# EAGLE design Big Nonaddressable Controller (EAGLE 7.7.0)
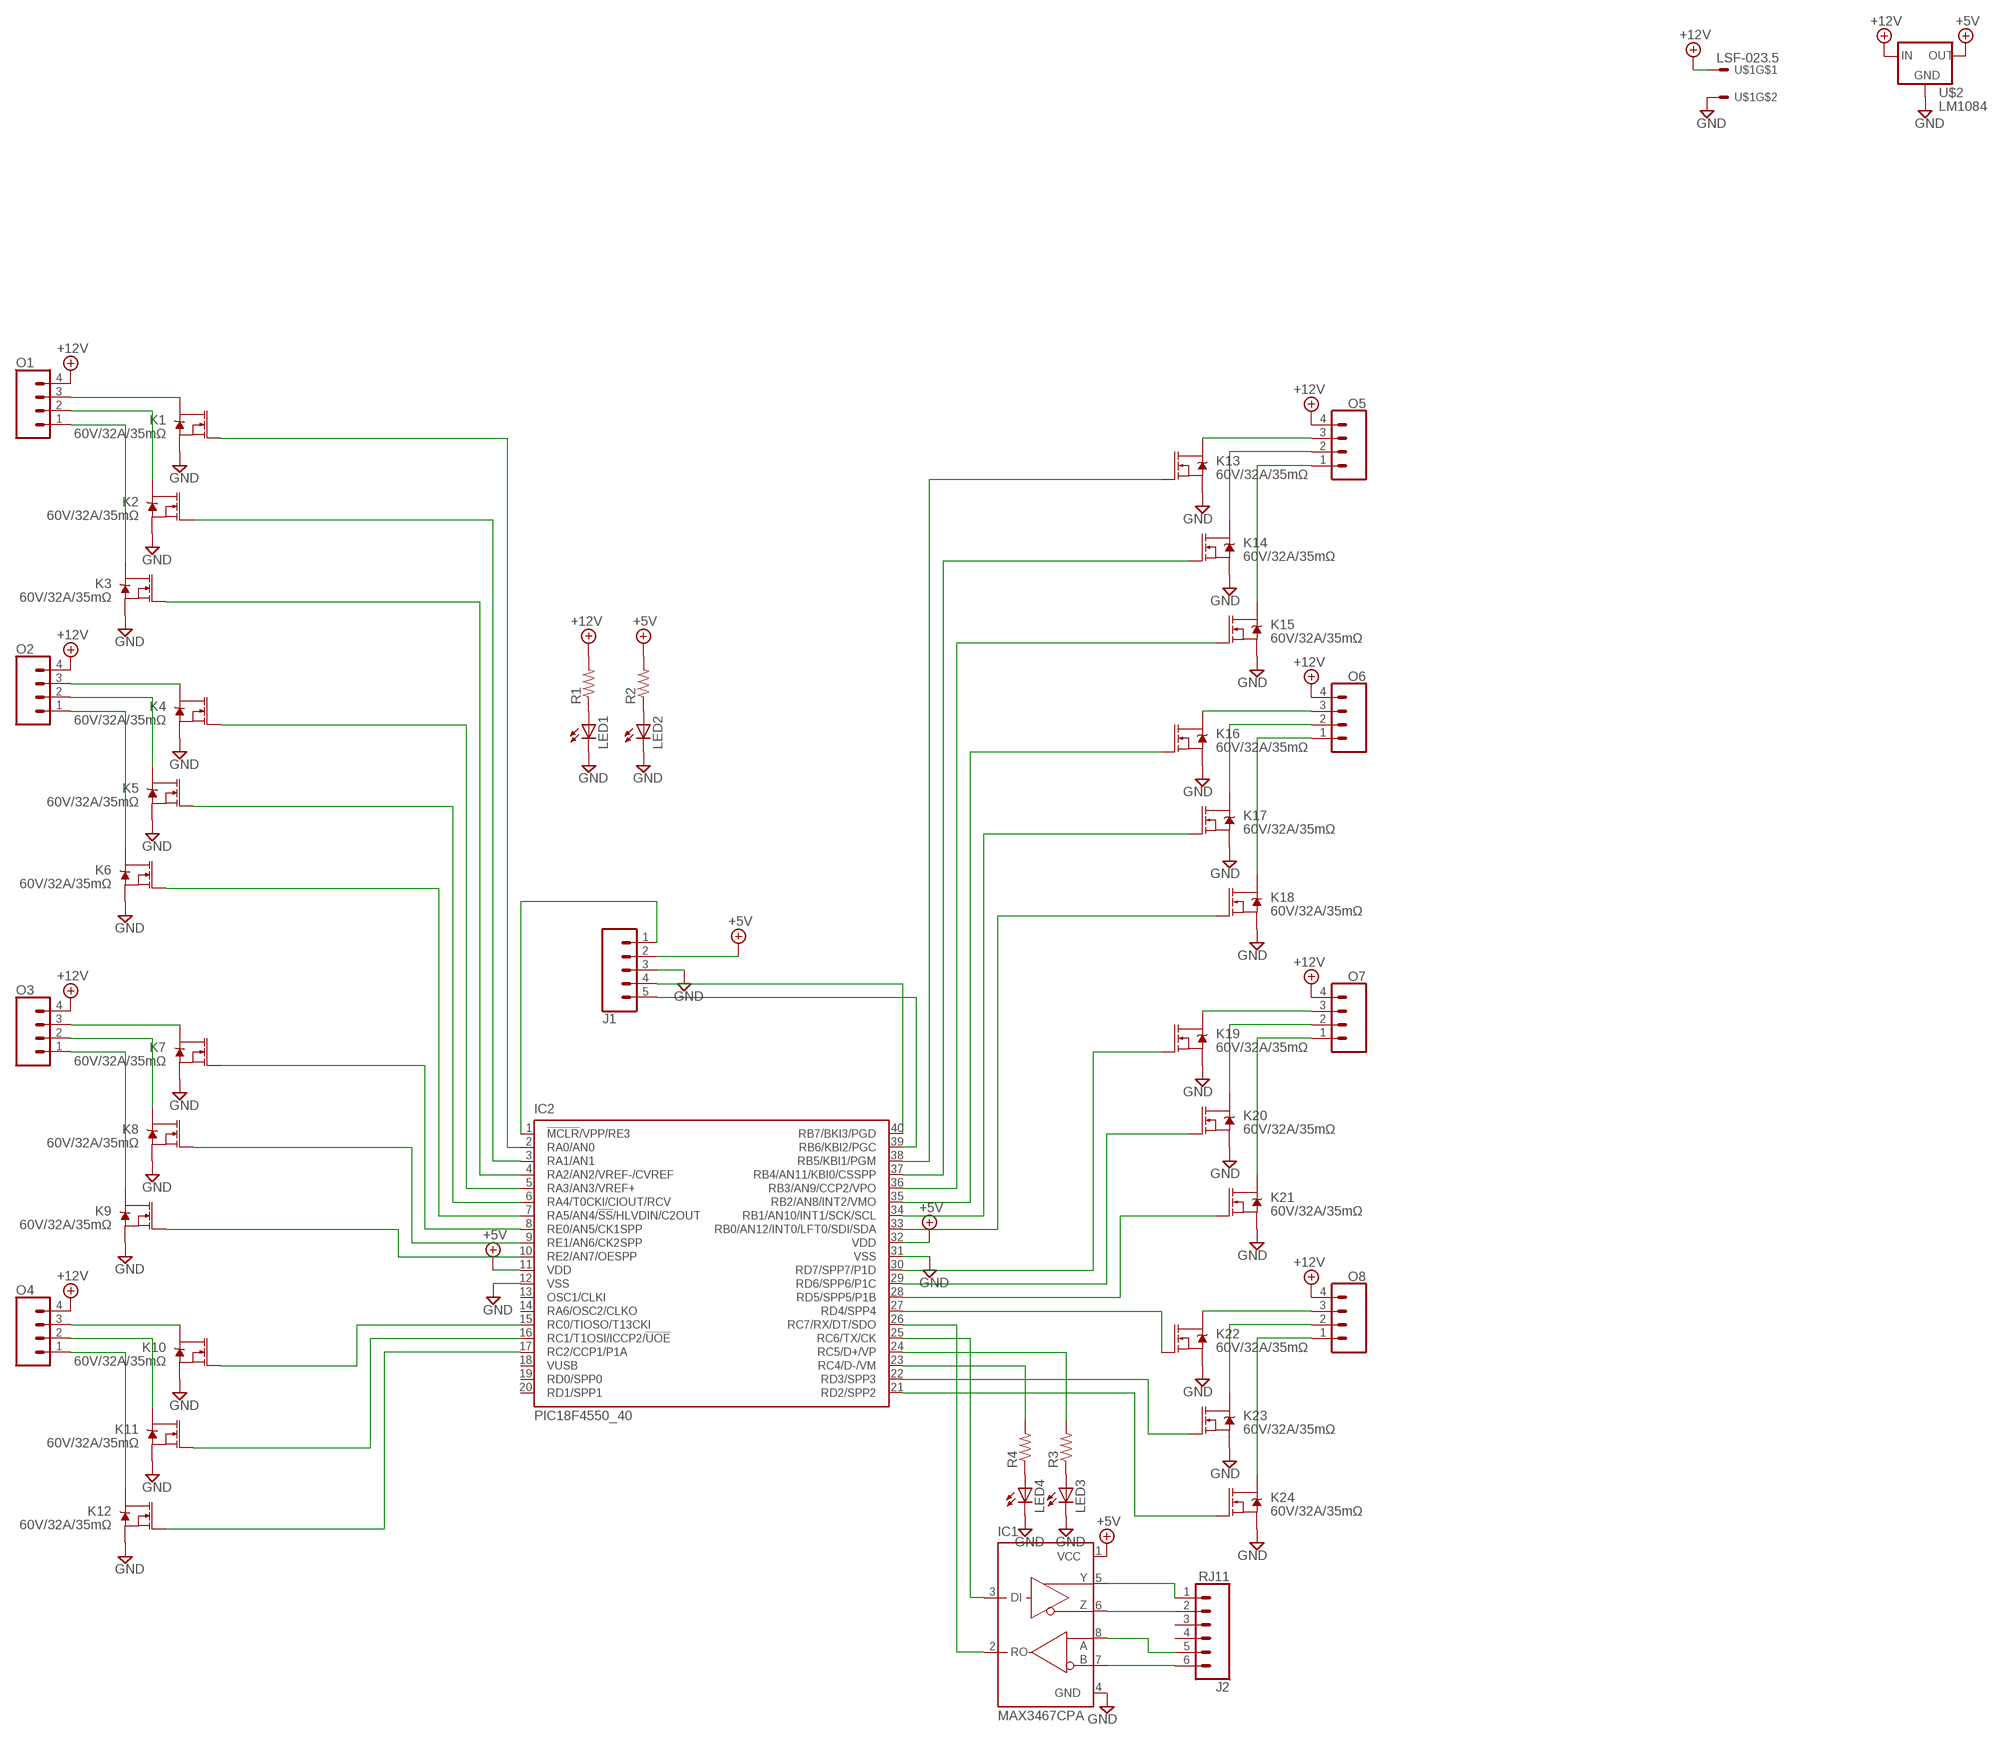
[diagram p0: schematic, sheet 1]

## Parts
IC1  MAX3467CPA  [SO08]
IC2  PIC18F4550_40  [DIL40]
J1  CONN_05  [1X05]
J2  RJ11  RJ11-6  [RJ11-6]
K1  60V/32A/35mΩ  MOSFET-NCH-FQP30N06L  [TO220V]
K2  60V/32A/35mΩ  MOSFET-NCH-FQP30N06L  [TO220V]
K3  60V/32A/35mΩ  MOSFET-NCH-FQP30N06L  [TO220V]
K4  60V/32A/35mΩ  MOSFET-NCH-FQP30N06L  [TO220V]
K5  60V/32A/35mΩ  MOSFET-NCH-FQP30N06L  [TO220V]
K6  60V/32A/35mΩ  MOSFET-NCH-FQP30N06L  [TO220V]
K7  60V/32A/35mΩ  MOSFET-NCH-FQP30N06L  [TO220V]
K8  60V/32A/35mΩ  MOSFET-NCH-FQP30N06L  [TO220V]
K9  60V/32A/35mΩ  MOSFET-NCH-FQP30N06L  [TO220V]
K10  60V/32A/35mΩ  MOSFET-NCH-FQP30N06L  [TO220V]
K11  60V/32A/35mΩ  MOSFET-NCH-FQP30N06L  [TO220V]
K12  60V/32A/35mΩ  MOSFET-NCH-FQP30N06L  [TO220V]
K13  60V/32A/35mΩ  MOSFET-NCH-FQP30N06L  [TO220V]
K14  60V/32A/35mΩ  MOSFET-NCH-FQP30N06L  [TO220V]
K15  60V/32A/35mΩ  MOSFET-NCH-FQP30N06L  [TO220V]
K16  60V/32A/35mΩ  MOSFET-NCH-FQP30N06L  [TO220V]
K17  60V/32A/35mΩ  MOSFET-NCH-FQP30N06L  [TO220V]
K18  60V/32A/35mΩ  MOSFET-NCH-FQP30N06L  [TO220V]
K19  60V/32A/35mΩ  MOSFET-NCH-FQP30N06L  [TO220V]
K20  60V/32A/35mΩ  MOSFET-NCH-FQP30N06L  [TO220V]
K21  60V/32A/35mΩ  MOSFET-NCH-FQP30N06L  [TO220V]
K22  60V/32A/35mΩ  MOSFET-NCH-FQP30N06L  [TO220V]
K23  60V/32A/35mΩ  MOSFET-NCH-FQP30N06L  [TO220V]
K24  60V/32A/35mΩ  MOSFET-NCH-FQP30N06L  [TO220V]
LED1  LED3MM  [LED3MM]
LED2  LED3MM  [LED3MM]
LED3  LED3MM  [LED3MM]
LED4  LED3MM  [LED3MM]
O1  CONN_04  [1X04]
O2  CONN_04  [1X04]
O3  CONN_04  [1X04]
O4  CONN_04  [1X04]
O5  CONN_04  [1X04]
O6  CONN_04  [1X04]
O7  CONN_04  [1X04]
O8  CONN_04  [1X04]
R1  R-US_0204/2V  [0204V]
R2  R-US_0204/2V  [0204V]
R3  R-US_0204/2V  [0204V]
R4  R-US_0204/2V  [0204V]
U$1  LSF-023.5  [LSF-3.5]
U$2  LM1084  [D2PACK]

## Nets
+5V: IC1.1(VCC) IC2.11(VDD) IC2.32(VDD) J1.2 R2.2 U$2.2(OUT)
+12V: O1.4 O2.4 O3.4 O4.4 O5.4 O6.4 O7.4 O8.4 R1.2 U$1.P$3 U$2.3(IN)
GND: IC1.4(GND) IC2.12(VSS) IC2.31(VSS) J1.3 K1.3(S) K2.3(S) K3.3(S) K4.3(S) K5.3(S) K6.3(S) K7.3(S) K8.3(S) K9.3(S) K10.3(S) K11.3(S) K12.3(S) K13.3(S) K14.3(S) K15.3(S) K16.3(S) K17.3(S) K18.3(S) K19.3(S) K20.3(S) K21.3(S) K22.3(S) K23.3(S) K24.3(S) LED1.K(C) LED2.K(C) LED3.K(C) LED4.K(C) U$1.P$4 U$2.1(GND)
N$1: IC2.40(RB7/BKI3/PGD) J1.4
N$2: IC2.39(RB6/KBI2/PGC) J1.5
N$3: IC1.2(RO) IC2.26(RC7/RX/DT/SDO)
N$4: IC1.3(DI) IC2.25(RC6/TX/CK)
N$5: K4.2(D) O2.3
N$6: K5.2(D) O2.2
N$7: K6.2(D) O2.1
N$8: IC2.2(RA0/AN0) K1.1(G)
N$9: IC2.3(RA1/AN1) K2.1(G)
N$10: IC2.4(RA2/AN2/VREF-/CVREF) K3.1(G)
N$11: IC2.1(!MCLR!/VPP/RE3) J1.1
N$12: IC2.5(RA3/AN3/VREF+) K4.1(G)
N$13: IC2.6(RA4/T0CKI/CIOUT/RCV) K5.1(G)
N$14: IC2.7(RA5/AN4/!SS!/HLVDIN/C2OUT) K6.1(G)
N$15: K7.2(D) O3.3
N$16: K8.2(D) O3.2
N$17: K9.2(D) O3.1
N$18: K10.2(D) O4.3
N$19: K11.2(D) O4.2
N$20: K12.2(D) O4.1
N$21: IC2.8(RE0/AN5/CK1SPP) K7.1(G)
N$22: IC2.9(RE1/AN6/CK2SPP) K8.1(G)
N$23: K1.2(D) O1.3
N$24: K2.2(D) O1.2
N$25: K3.2(D) O1.1
N$26: IC2.10(RE2/AN7/OESPP) K9.1(G)
N$27: IC2.17(RC2/CCP1/P1A) K12.1(G)
N$28: IC2.16(RC1/T1OSI/ICCP2/!UOE) K11.1(G)
N$29: IC2.15(RC0/TIOSO/T13CKI) K10.1(G)
N$30: K13.2(D) O5.3
N$31: K14.2(D) O5.2
N$32: K15.2(D) O5.1
N$33: IC2.38(RB5/KBI1/PGM) K13.1(G)
N$34: IC2.37(RB4/AN11/KBI0/CSSPP) K14.1(G)
N$35: IC2.36(RB3/AN9/CCP2/VPO) K15.1(G)
N$36: K16.2(D) O6.3
N$37: K17.2(D) O6.2
N$38: K18.2(D) O6.1
N$39: IC2.35(RB2/AN8/INT2/VMO) K16.1(G)
N$40: IC2.34(RB1/AN10/INT1/SCK/SCL) K17.1(G)
N$41: IC2.33(RB0/AN12/INT0/LFT0/SDI/SDA) K18.1(G)
N$42: K19.2(D) O7.3
N$43: K20.2(D) O7.2
N$44: K21.2(D) O7.1
N$45: K22.2(D) O8.3
N$46: K23.2(D) O8.2
N$47: K24.2(D) O8.1
N$48: IC2.30(RD7/SPP7/P1D) K19.1(G)
N$49: IC2.29(RD6/SPP6/P1C) K20.1(G)
N$50: IC2.28(RD5/SPP5/P1B) K21.1(G)
N$51: IC2.27(RD4/SPP4) K22.1(G)
N$52: IC2.22(RD3/SPP3) K23.1(G)
N$53: IC2.21(RD2/SPP2) K24.1(G)
N$54: IC1.7(B) J2.6
N$55: IC1.8(A) J2.5
N$56: IC1.5(Y) J2.1
N$57: IC1.6(Z) J2.2
N$58: LED1.A R1.1
N$59: LED2.A R2.1
N$60: LED3.A R3.1
N$61: LED4.A R4.1
N$62: IC2.24(RC5/D+/VP) R3.2
N$63: IC2.23(RC4/D-/VM) R4.2
Unconnected: IC2.13(OSC1/CLKI) IC2.14(RA6/OSC2/CLKO) IC2.18(VUSB) IC2.19(RD0/SPP0) IC2.20(RD1/SPP1) J2.3 J2.4

## Library data of the parts
IC1 = maxim:MAX3467*: +5V, Fail-Safe, 40Mbps, Profibus RS-485/RS-422 Transceivers Source: MAX3465-MAX3469.pdf; OC_FARNELL: unknown; OC_NEWARK: unknown
IC2 = microchip:PIC18F4*_40: USB Microcontrollers with nanoWatt Technology High-Performance, Enhanced Flash, 28/40/44-Pin, Source: http://ww1.microchip.com/downloads/en/devicedoc/39632c.pdf; MF: MICROCHIP; MPN: PIC18F4550-I/P; OC_FARNELL: 9321357; OC_NEWARK: 74K8623
J1 = SparkFun-Connectors:CONN_05: Multi connection point. Often used as Generic Header-pin footprint for 0.1 inch spaced/style header connections On any of the 0.1 inch spaced packages, you can populate with these: Break Away Headers - Straight <https://www.sparkfun.com/products/116> (PRT-00116) Break Away Male Headers - Right Angle <https://www.sparkfun.com/products/553> (PRT-00553) Female Headers <https://www.sparkfun.com/products/115> (PRT-00115) Break Away Headers - Machine Pin <https://www.sparkfun.com/products/117> (PRT-00117) Break Away Female Headers - Swiss Machine Pin <https://www.sparkfun.com/products/743> (PRT-00743) For SCREWTERMINALS and SPRING TERMINALS visit here: Screw Terimnals on SparkFun.com <https://www.sparkfun.com/search/results?term=Screw+Terminals> (5mm/3.5mm/2.54mm spacing) This device is also useful as a general connection point to wire up your design to another part of your project. Our various solder wires solder well into these plated through hole pads. Hook-Up Wire - Assortment (Stranded, 22 AWG) <https://www.sparkfun.com/products/11375> (PRT-11375) Hook-Up Wire - Assortment (Solid Core, 22 AWG) <https://www.sparkfun.com/products/11367> (PRT-11367) View the entire wire category on our website here <https://www.sparkfun.com/categories/141> Special notes: Molex polarized connector foot print use with SKU : PRT-08231 with associated crimp pins and housings. 1MM SMD Version SKU: PRT-10208
J2 = SparkFun-Connectors:RJ11-6: RJ11 Jack - 6 pin Commonly found on CAT3 devices and some Microchip programmers. Here is the connector we sell at SparkFun: RJ11 6-Pin Connector <https://www.sparkfun.com/products/132> (PRT-00132) Datasheet <http://www.sparkfun.com/datasheets/Prototyping/Connectors/RJ11-Datasheet.pdf> It is used on this SparkFun product: SparkFun Weather Shield <https://www.sparkfun.com/products/12081> (DEV-12081) Weather Meters <https://www.sparkfun.com/products/8942> (SEN-08942); PROD_ID: CONN-08590; SF_ID: PRT-00132
K1-K24 = SparkFun-DiscreteSemi:MOSFET-NCH: N-channel MOSFETs Voltage controlled devices that allow control of high current outputs. SparkFun Products: SparkFun OpenScale <https://www.sparkfun.com/products/13261> SparkFun Digital Sandbox <https://www.sparkfun.com/products/12651> SparkFun Monster Moto Shield <https://www.sparkfun.com/products/10182> SparkFun MOSFET Power Controller <https://www.sparkfun.com/products/11214>; PROD_ID: TRANS-10060
LED1-LED4 = led:LED: LED OSRAM: - CHIPLED LG R971, LG N971, LY N971, LG Q971, LY Q971, LO R971, LY R971 LH N974, LH R974 LS Q976, LO Q976, LY Q976 LO Q996 - Hyper CHIPLED LW Q18S LB Q993, LB Q99A, LB R99A - SideLED LS A670, LO A670, LY A670, LG A670, LP A670 LB A673, LV A673, LT A673, LW A673 LH A674 LY A675 LS A676, LA A676, LO A676, LY A676, LW A676 LS A679, LY A679, LG A679 - Hyper Micro SIDELED® LS Y876, LA Y876, LO Y876, LY Y876 LT Y87S - SmartLED LW L88C, LW L88S LB L89C, LB L89S, LG L890 LS L89K, LO L89K, LY L89K LS L896, LA L896, LO L896, LY L896 - TOPLED LS T670, LO T670, LY T670, LG T670, LP T670 LSG T670, LSP T670, LSY T670, LOP T670, LYG T670 LG T671, LOG T671, LSG T671 LB T673, LV T673, LT T673, LW T673 LH T674 LS T676, LA T676, LO T676, LY T676, LB T676, LH T676, LSB T676, LW T676 LB T67C, LV T67C, LT T67C, LS T67K, LO T67K, LY T67K, LW E67C LS E67B, LA E67B, LO E67B, LY E67B, LB E67C, LV E67C, LT E67C LW T67C LS T679, LY T679, LG T679 LS T770, LO T770, LY T770, LG T770, LP T770 LB T773, LV T773, LT T773, LW T773 LH T774 LS E675, LA E675, LY E675, LS T675 LS T776, LA T776, LO T776, LY T776, LB T776 LHGB T686 LT T68C, LB T68C - Hyper Mini TOPLED® LB M676 - Mini TOPLED Santana® LG M470 LS M47K, LO M47K, LY M47K Source: http://www.osram.convergy.de LUXEON: - LUMILED® LXK2-PW12-R00, LXK2-PW12-S00, LXK2-PW14-U00, LXK2-PW14-V00 LXK2-PM12-R00, LXK2-PM12-S00, LXK2-PM14-U00 LXK2-PE12-Q00, LXK2-PE12-R00, LXK2-PE12-S00, LXK2-PE14-T00, LXK2-PE14-U00 LXK2-PB12-K00, LXK2-PB12-L00, LXK2-PB12-M00, LXK2-PB14-N00, LXK2-PB14-P00, LXK2-PB14-Q00 LXK2-PR12-L00, LXK2-PR12-M00, LXK2-PR14-Q00, LXK2-PR14-R00 LXK2-PD12-Q00, LXK2-PD12-R00, LXK2-PD12-S00 LXK2-PH12-R00, LXK2-PH12-S00 LXK2-PL12-P00, LXK2-PL12-Q00, LXK2-PL12-R00 Source: www.luxeon.com KINGBRIGHT: KA-3528ASYC Source: www.kingbright.com
O1-O8 = SparkFun-Connectors:CONN_04: Multi connection point. Often used as Generic Header-pin footprint for 0.1 inch spaced/style header connections On any of the 0.1 inch spaced packages, you can populate with these: Break Away Headers - Straight <https://www.sparkfun.com/products/116> (PRT-00116) Break Away Male Headers - Right Angle <https://www.sparkfun.com/products/553> (PRT-00553) Female Headers <https://www.sparkfun.com/products/115> (PRT-00115) Break Away Headers - Machine Pin <https://www.sparkfun.com/products/117> (PRT-00117) Break Away Female Headers - Swiss Machine Pin <https://www.sparkfun.com/products/743> (PRT-00743) For SCREWTERMINALS and SPRING TERMINALS visit here: Screw Terimnals on SparkFun.com <https://www.sparkfun.com/search/results?term=Screw+Terminals> (5mm/3.5mm/2.54mm spacing) This device is also useful as a general connection point to wire up your design to another part of your project. Our various solder wires solder well into these plated through hole pads. Hook-Up Wire - Assortment (Stranded, 22 AWG) <https://www.sparkfun.com/products/11375> (PRT-11375) Hook-Up Wire - Assortment (Solid Core, 22 AWG) <https://www.sparkfun.com/products/11367> (PRT-11367) View the entire wire category on our website here <https://www.sparkfun.com/categories/141> Special notes: Molex polarized connector foot print use with SKU : PRT-08231 with associated crimp pins and housings. 1MM SMD Version SKU: PRT-10208; PROD_ID: CONN-09696
R1-R4 = resistor:R-US_: RESISTOR, American symbol
U$1 = FRC696:LSF-02
U$2 = FRC696:LM1084

## Board
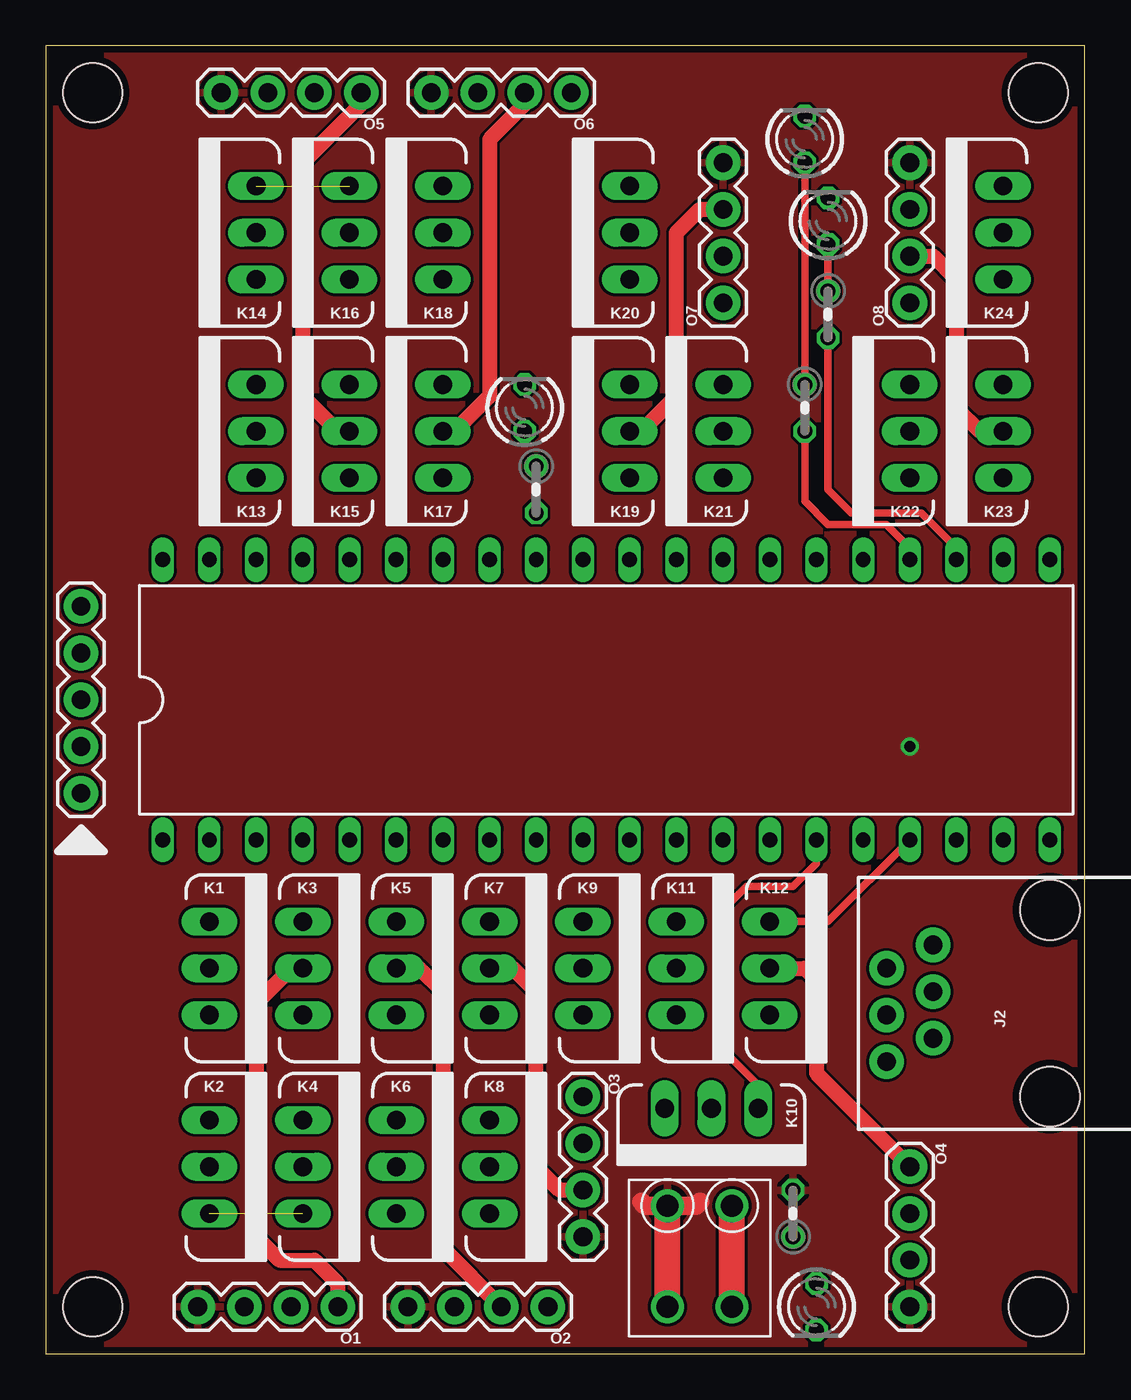
[diagram p1: board, top side]
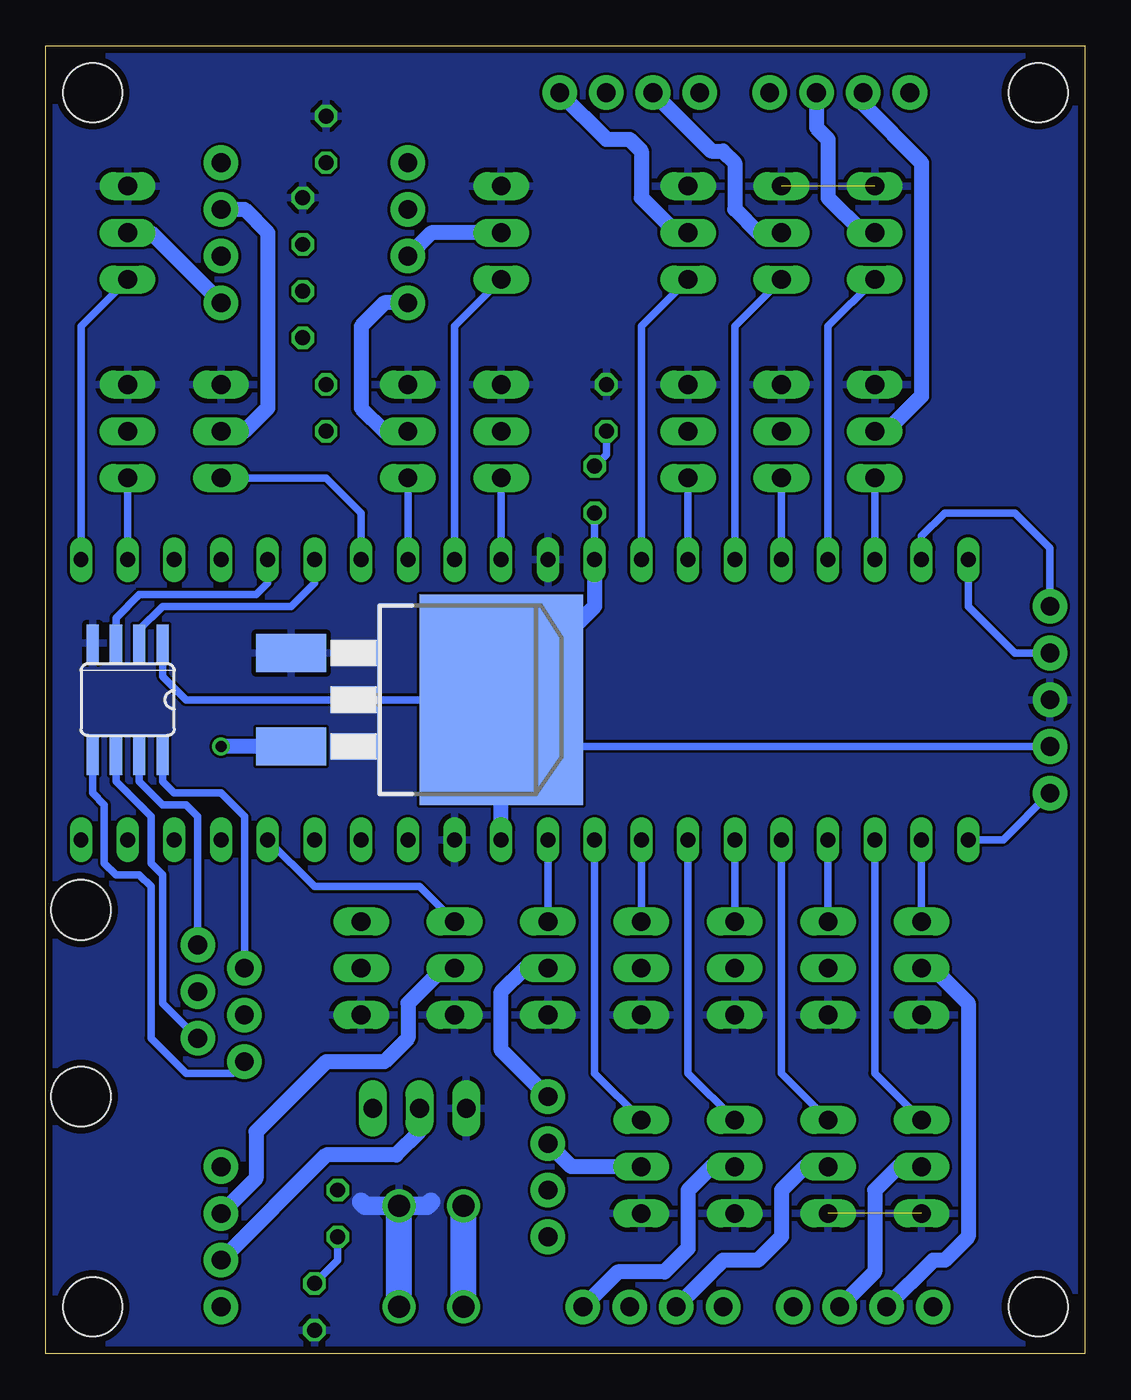
[diagram p2: board, bottom side, seen from below]

Size 56.52 x 71.12 mm. Coordinates in mm from the lower left corner, seen from the top.
Outline: 0,0 56.52,0 56.52,71.12 0,71.12 0,0
Copper layers (1*16): Top 0.0356mm / dielectric 1.5011mm / Bottom 0.0356mm
Design rules "Oshpark": minimum track width 6mil, minimum drill 13mil, track to track 6mil, track to pad 6mil, pad to pad 6mil, via to via 6mil, smd to smd 6mil, copper to edge 15mil, drill to drill 6mil, minimum pad ring 7mil, minimum via ring 7mil, stop-mask expansion 3mil, vias tented up to drill 0mil, thermal gap 10mil
Holes 3.2 mm at 2.54,2.54 2.54,68.58 53.98,68.58 53.98,2.54

### Footprints (pad centres in the part's own frame; a part is rotated, then mirrored left to right if it is on the bottom)
SO08 = smd 0.66 x 2.032: 1 -1.905,-3.073; 2 -0.635,-3.073; 3 0.635,-3.073; 4 1.905,-3.073; 5 1.905,3.073; 6 0.635,3.073; 7 -0.635,3.073; 8 -1.905,3.073
DIL40 = drill 0.813 long: 1 -24.13,-7.62; 2 -21.59,-7.62; 3 -19.05,-7.62; 4 -16.51,-7.62; 5 -13.97,-7.62; 6 -11.43,-7.62; 7 -8.89,-7.62; 8 -6.35,-7.62; 9 -3.81,-7.62; 10 -1.27,-7.62; 11 1.27,-7.62; 12 3.81,-7.62; 13 6.35,-7.62; 14 8.89,-7.62; 15 11.43,-7.62; 16 13.97,-7.62; 17 16.51,-7.62; 18 19.05,-7.62; 19 21.59,-7.62; 20 24.13,-7.62; 21 24.13,7.62; 22 21.59,7.62; 23 19.05,7.62; 24 16.51,7.62; 25 13.97,7.62; 26 11.43,7.62; 27 8.89,7.62; 28 6.35,7.62; 29 3.81,7.62; 30 1.27,7.62; 31 -1.27,7.62; 32 -3.81,7.62; 33 -6.35,7.62; 34 -8.89,7.62; 35 -11.43,7.62; 36 -13.97,7.62; 37 -16.51,7.62; 38 -19.05,7.62; 39 -21.59,7.62; 40 -24.13,7.62
1X05 = drill 1.016 pad 1.88: 1 0,0; 2 2.54,0; 3 5.08,0; 4 7.62,0; 5 10.16,0
RJ11-6 = drill 1.016 pad 1.88: 1 -3.175,8.89; 2 -1.905,6.35; 3 -0.635,8.89; 4 0.635,6.35; 5 1.905,8.89; 6 3.175,6.35 | hole 3.251: -5.08,0; 5.08,0
TO220V = drill 1.016 long: 1 -2.54,0; 2 0,0; 3 2.54,0
LED3MM = drill 0.813 octagon: A -1.27,0; K 1.27,0
1X04 = drill 1.016 pad 1.88: 1 0,0; 2 2.54,0; 3 5.08,0; 4 7.62,0
0204V = drill 0.813 octagon: 1 -1.27,0; 2 1.27,0
LSF-3.5 = drill 1.2: P$1 -1.75,0; P$2 1.75,0; P$3 -1.75,5.5; P$4 1.75,5.5
D2PACK = smd 2.083 x 3.81: 1 -2.54,-8.89; 3 2.54,-8.89 | smd 11.43 x 8.89: 2 0,2.54

### Placement (x,y rotation side)
IC1  52.07,35.56 180 bottom
IC2  30.48,35.56 0 top
J1  1.91,30.48 90 top
J2  54.61,19.05 90 top
K1  8.89,20.95 270 top
K2  8.89,10.16 270 top
K3  13.97,20.95 270 top
K4  13.97,10.16 270 top
K5  19.05,20.95 270 top
K6  19.05,10.16 270 top
K7  24.13,20.95 270 top
K8  24.13,10.16 270 top
K9  29.21,20.95 270 top
K10  36.2,13.34 180 top
K11  34.29,20.95 270 top
K12  39.37,20.95 270 top
K13  11.43,50.16 90 top
K14  11.43,60.96 90 top
K15  16.51,50.16 90 top
K16  16.51,60.96 90 top
K17  21.59,50.16 90 top
K18  21.59,60.96 90 top
K19  31.75,50.16 90 top
K20  31.75,60.96 90 top
K21  36.83,50.16 90 top
K22  46.99,50.16 90 top
K23  52.07,50.16 90 top
K24  52.07,60.96 90 top
LED1  41.91,2.54 270 top
LED2  26.04,51.44 90 top
LED3  41.27,66.04 90 top
LED4  42.55,61.59 90 top
O1  15.88,2.54 180 top
O2  27.3,2.54 180 top
O3  29.21,13.97 270 top
O4  46.99,10.16 270 top
O5  17.14,68.58 180 top
O6  28.57,68.58 180 top
O7  36.83,57.15 90 top
O8  46.99,57.15 90 top
R1  40.64,7.62 90 top
R2  26.67,46.99 270 top
R3  41.27,51.44 270 top
R4  42.55,56.52 270 top
U$1  35.56,2.54 0 top
U$2  34.29,35.56 270 bottom

### Tracks (layer width: path | path; a pad name or v marks a point on that pad's centre or on a via)
+5V
  Bottom 0.406: J1.2 31.75,33.02 | U$2.2 48.9,35.56 50.16,36.83 IC1.1 | R2.2 IC2.32
  Bottom 0.813: IC2.11 31.75,33.02 U$2.2 26.67,40.64 IC2.32
+12V  (via drill 0.6)
  Top 1.016: 32.38,8.26 32.6,8.04 U$1.P$3 35.34,8.04 35.56,8.26
  Bottom 0.813: U$2.3 v46.99,33.02
  pour Top: -1.27,93.98 -1.27,-17.78 57.15,-17.78 57.15,93.98
GND  (2 unrouted)
  Bottom 1.016: 39.37,8.26 39.16,8.04 U$1.P$4 35.77,8.04 35.56,8.26
  pour Bottom: -34.29,72.39 102.87,72.39 102.87,-1.27 -34.29,-1.27
N$1
  Bottom 0.406: J1.4 3.81,38.1 6.35,40.64 IC2.40
N$2
  Bottom 0.406: J1.5 1.91,43.81 3.81,45.72 7.62,45.72 8.89,44.45 IC2.39
N$3
  Bottom 0.406: IC2.26 41.91,41.91 43.18,40.64 50.16,40.64 51.44,39.37 IC1.2
N$4
  Bottom 0.406: IC2.25 44.45,41.91 45.09,41.27 51.44,41.27 52.7,40.01 IC1.3
N$5
  Bottom 0.813: K4.2 15.24,10.16 16.51,8.89 16.51,6.35 17.78,5.08 19.68,5.08 O2.3
N$6
  Top 0.813: K5.2 20.32,20.95 21.59,19.68 21.59,5.71 O2.2
N$7
  Bottom 0.813: K6.2 20.32,10.16 21.59,8.89 21.59,5.71 22.86,4.45 25.4,4.45 O2.1
N$8
  Bottom 0.406: IC2.2 K1.1
N$9
  Bottom 0.406: IC2.3 11.43,15.24 K2.1
N$10
  Bottom 0.406: IC2.4 K3.1
N$11
  Bottom 0.406: IC2.1 4.45,27.94 J1.1
N$12
  Bottom 0.406: IC2.5 16.51,15.24 K4.1
N$13
  Bottom 0.406: IC2.6 K5.1
N$14
  Bottom 0.406: IC2.7 21.59,15.24 K6.1
N$15
  Top 0.813: O3.3 27.94,8.89 26.67,10.16 26.67,19.68 25.4,20.95 K7.2
N$16
  Bottom 0.813: K8.2 27.94,10.16 O3.2
N$17
  Bottom 0.813: O3.1 31.75,16.51 31.75,19.68 30.48,20.95 K9.2
N$18
  Bottom 0.813: K10.2 36.2,12.06 37.47,10.79 41.27,10.79 O4.3
N$19
  Bottom 0.813: K11.2 34.92,20.95 36.83,19.05 36.83,17.14 38.1,15.88 41.27,15.88 45.09,12.06 45.09,9.53 O4.2
N$20
  Top 0.813: K12.2 41.27,20.95 41.91,20.32 41.91,15.24 O4.1
N$21
  Bottom 0.406: IC2.8 K7.1
N$22
  Bottom 0.406: IC2.9 26.67,15.24 K8.1
N$23
  Bottom 0.813: K1.2 8.26,20.95 6.35,19.05 6.35,6.35 7.62,5.08 8.26,5.08 O1.3
N$24
  Bottom 0.813: K2.2 10.16,10.16 11.43,8.89 11.43,4.45 O1.2
N$25
  Top 0.813: K3.2 13.34,20.95 11.43,19.05 11.43,6.35 12.7,5.08 14.61,5.08 15.88,3.81 O1.1
N$26
  Bottom 0.406: IC2.10 K9.1
N$27
  Top 0.406: IC2.17 42.55,23.5 K12.1
N$28
  Bottom 0.406: IC2.16 41.91,25.4 36.2,25.4 K11.1
N$29
  Top 0.406: IC2.15 41.91,26.67 40.64,25.4 38.1,25.4 36.83,24.13 36.83,16.51 38.73,14.61 K10.1
N$30
  Bottom 0.813: O5.3 12.06,67.94 8.89,64.77 8.89,52.07 10.79,50.16 K13.2
N$31
  Bottom 0.813: O5.2 14.61,66.67 13.97,66.04 13.97,62.87 12.06,60.96 K14.2
N$32
  Top 0.813: O5.1 17.14,67.94 13.97,64.77 13.97,52.07 15.88,50.16 K15.2
N$33
  Bottom 0.406: IC2.38 K13.1
N$34
  Bottom 0.406: IC2.37 13.97,55.88 K14.1
N$35
  Bottom 0.406: IC2.36 K15.1
N$36
  Bottom 0.813: O6.3 20.32,65.41 19.68,65.41 19.05,64.77 19.05,62.23 17.78,60.96 K16.2
N$37
  Top 0.813: O6.2 26.04,67.94 24.13,66.04 24.13,52.07 22.23,50.16 K17.2
N$38
  Bottom 0.813: O6.1 26.04,66.04 24.77,66.04 24.13,65.41 24.13,62.87 22.23,60.96 K18.2
N$39
  Bottom 0.406: IC2.35 19.05,55.88 K16.1
N$40
  Bottom 0.406: IC2.34 K17.1
N$41
  Bottom 0.406: IC2.33 24.13,55.88 K18.1
N$42
  Top 0.813: K19.2 32.38,50.16 34.29,52.07 34.29,60.96 35.56,62.23 O7.3
N$43
  Bottom 0.813: K20.2 35.56,60.96 O7.2
N$44
  Bottom 0.813: O7.1 38.1,57.15 39.37,55.88 39.37,51.44 38.1,50.16 K21.2
N$45
  Bottom 0.813: O8.3 45.72,62.23 44.45,60.96 44.45,51.44 45.72,50.16 K22.2
N$46
  Top 0.813: O8.2 48.26,59.69 49.53,58.42 49.53,51.44 50.8,50.16 K23.2
N$47
  Bottom 0.813: O8.1 50.8,60.96 K24.2
N$48
  Bottom 0.406: IC2.30 K19.1
N$49
  Bottom 0.406: IC2.29 34.29,55.88 K20.1
N$50
  Bottom 0.406: IC2.28 K21.1
N$51
  Bottom 0.406: IC2.27 39.37,45.72 41.27,47.62 K22.1
N$52
  Bottom 0.406: IC2.22 K23.1
N$53
  Bottom 0.406: IC2.21 54.61,55.88 K24.1
N$54
  Bottom 0.406: IC1.7 51.44,31.11 50.16,29.84 48.9,29.84 48.26,29.21 J2.6
N$55
  Bottom 0.406: IC1.8 50.16,31.11 49.53,30.48 46.99,30.48 45.72,29.21 J2.5
N$56
  Bottom 0.406: IC1.5 53.98,30.48 53.34,29.84 53.34,26.67 52.7,26.04 51.44,26.04 50.8,25.4 50.8,17.14 48.9,15.24 46.35,15.24 J2.1
N$57
  Bottom 0.406: IC1.6 52.7,31.11 50.8,29.21 50.8,26.67 50.16,26.04 50.16,19.05 J2.2
N$58
  Bottom 0.406: R1.1 40.64,5.08 LED1.A
N$59
  Bottom 0.406: LED2.A 26.04,48.9 R2.1
N$60
  Top 0.406: R3.1 LED3.A
N$61
  Top 0.406: R4.1 LED4.A
N$62
  Top 0.406: IC2.24 46.99,43.81 45.72,45.09 42.55,45.09 41.27,46.35 R3.2
N$63
  Top 0.406: IC2.23 49.53,43.81 47.62,45.72 43.81,45.72 42.55,46.99 R4.2